# Altium schematic sheet FrontPanelConnector.SchDoc
size A4; Date: 08.04.2017; ApprovedBy: ApprovedBy; CheckedBy: CheckedBy; Author: Jan Petrik; CompanyName: FreeDSP; DrawnBy: Jan Petrik; Organization: FreeDSP; DocumentNumber: 15; Revision: B2; SheetNumber: 15; SheetTotal: 16; Version1: N/A; Version2: N/A; Version3: N/A; Change1description: N/A; Change2description: N/A; Change3description: N/A; Change1DrawnBy: N/A; Change2DrawnBy: N/A; Change3DrawnBy: N/A; Change1CheckedBy: N/A; Change2CheckedBy: N/A; Change3CheckedBy: N/A; PreviusVersion_Chng1: N/A; PreviusVersion_Chng2: N/A; PreviusVersion_Chng3: N/A; Variant1description: Standard assembly; Variant2description: N/A; Variant3description: N/A; Variant4description: N/A; email: jan_petrik@centrum.cz; license: CC BY-NC 4.0; PageSetup: Record=PageOptions|CenterHorizontal=True|CenterVertical=True|PrintScale=0.97|XCorrection=1.00|YCorrection=1.00|PrintKind=2|BorderSize=5000000|LeftOffset=0|BottomOffset=0|Orientation=2|PaperLength=1000|PaperWidth=1000|Scale=100|PaperSource=7|PrintQuality=-3|MediaType=1|DitherType=10|PrintScaleMode=1|PaperKind=A4|PaperIndex=9; drawing number: blablabla; DocumentName: Docname
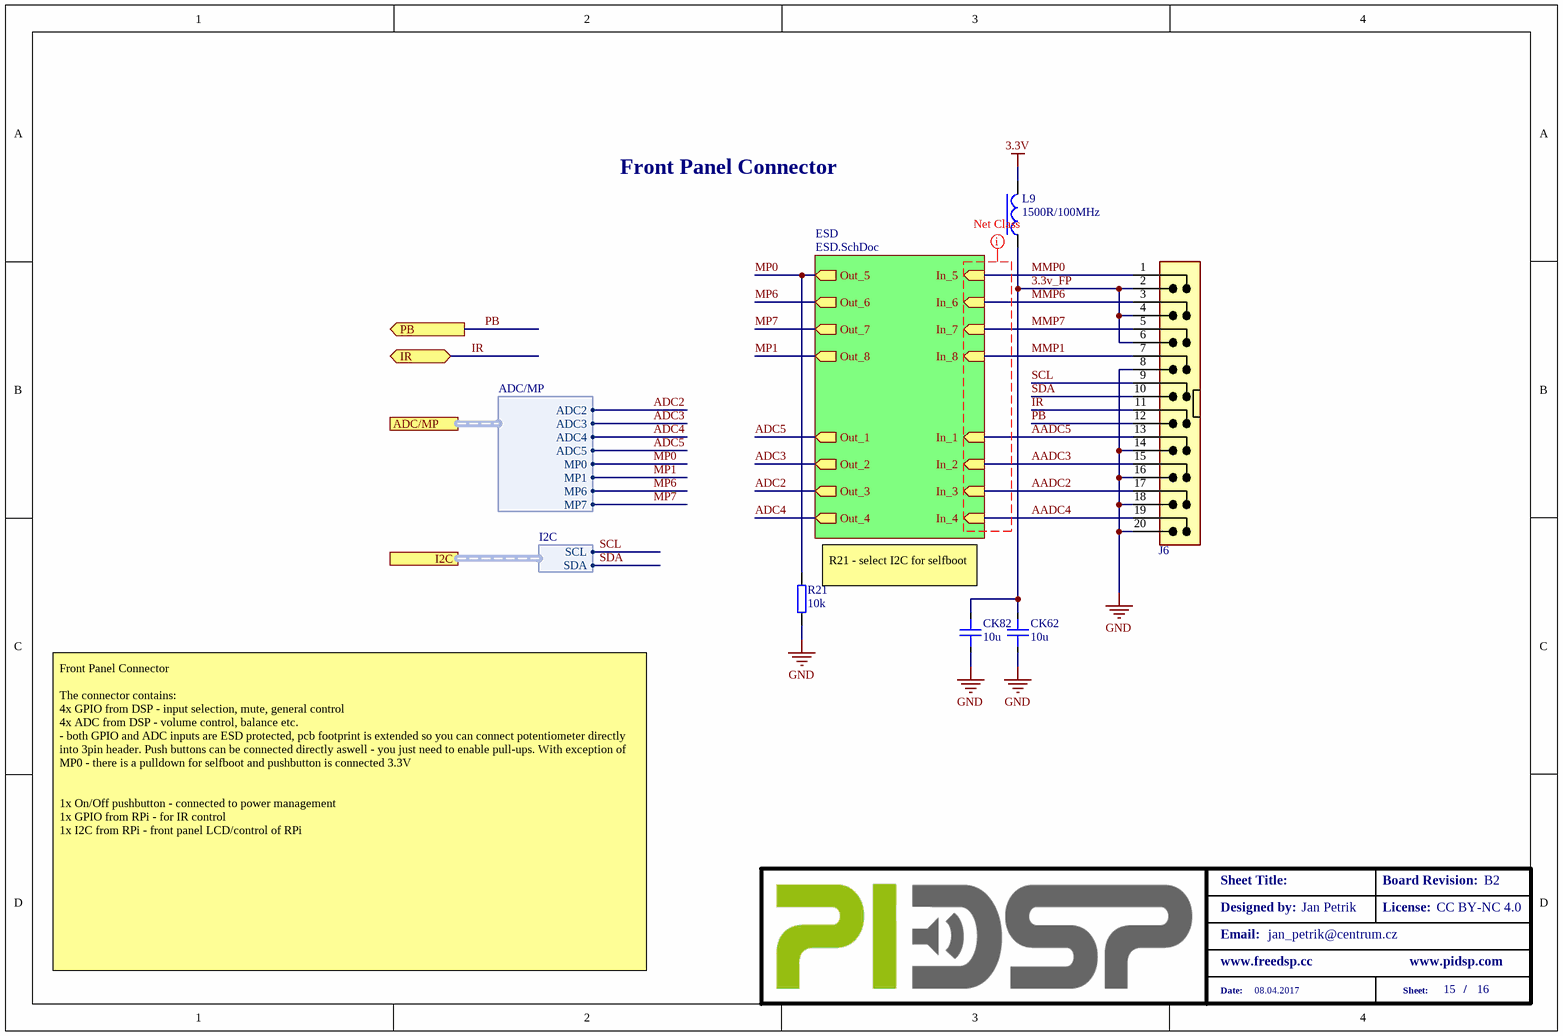
[diagram p0: FrontPanelConnector.SchDoc]

## Parts
CK62  10u  [CAPC3216X12N(SMC1206)]
CK82  10u  [CAPC3216X12N(SMC1206)]
J6  MLW 2x10  [MLW20G_BG]  (value not drawn)
L9  1500R/100MHz  [INDC2012X08N(SML0805)]
R21  10k  [RESC1608X06N(SMR0603)]

## Sub-sheets
ESD = ESD.SchDoc: In_7 (in), In_4 (in), In_3 (in), Out_7 (out), In_8 (in), Out_8 (out), In_6 (in), In_5 (in), Out_5 (out), Out_6 (out), Out_2 (out), Out_4 (out), In_1 (in), In_2 (in), Out_3 (out), Out_1 (out)

## Ports
ADC/MP (harness ADC/MP), I2C (harness I2C), IR (bidir), PB (out)

## Harnesses
ADC/MP: ADC2, ADC3, ADC4, ADC5, MP1, MP0, MP7, MP6
I2C: SCL, SDA

## Nets
3.3V: L9.2
GND: CK62.2 CK82.2 J6.8 J6.14 J6.16 J6.18 J6.20 R21.1
3.3v_FP: CK62.1 CK82.1 J6.2 J6.4 J6.6 L9.1
AADC2: J6.17 ; sheet ESD/In_3
AADC3: J6.15 ; sheet ESD/In_2
AADC4: J6.19 ; sheet ESD/In_4
AADC5: J6.13 ; sheet ESD/In_1
ADC2: sheet ESD/Out_3, port ADC/MP.ADC2
ADC3: sheet ESD/Out_2, port ADC/MP.ADC3
ADC4: sheet ESD/Out_4, port ADC/MP.ADC4
ADC5: sheet ESD/Out_1, port ADC/MP.ADC5
IR: J6.11 ; port IR
MMP0: J6.1 ; sheet ESD/In_5
MMP1: J6.7 ; sheet ESD/In_8
MMP6: J6.3 ; sheet ESD/In_6
MMP7: J6.5 ; sheet ESD/In_7
MP0: R21.2 ; sheet ESD/Out_5, port ADC/MP.MP0
MP1: sheet ESD/Out_8, port ADC/MP.MP1
MP6: sheet ESD/Out_6, port ADC/MP.MP6
MP7: sheet ESD/Out_7, port ADC/MP.MP7
PB: J6.12 ; port PB
SCL: J6.9 ; port I2C.SCL
SDA: J6.10 ; port I2C.SDA

## Layout directives
net class ReducedClearence: (no net found under the mark)

## Notes on the sheet
- Front Panel Connector
- R21 - select I2C for selfboot
- Front Panel Connector
  The connector contains:
  4x GPIO from DSP - input selection, mute, general control
  4x ADC from DSP - volume control, balance etc.
  - both GPIO and ADC inputs are ESD protected, pcb footprint is extended so you can connect potentiometer directly into 3pin header. Push buttons can be connected directly aswell - you just need to enable pull-ups. With exception of  MP0 - there is a pulldown for selfboot and pushbutton is connected 3.3V
  1x On/Off pushbutton - connected to power management
  1x GPIO from RPi - for IR control
  1x I2C from RPi - front panel LCD/control of RPi
- Designed by:
- Sheet Title:
- Board Revision:
- License:
- Email:
- www.freedsp.cc
- www.pidsp.com
- Date:
- Sheet:
- /

## Library data of the parts
CK62 CK82 = 10u-50V-1206-X5R: MLCC; Signal Integrity: Cap; Tolerance: 10%; Voltage: 50; Mfgr. PN: GRM31CR61H106MA2L; Mfgr.: Murata; Value: 10u; Package: SMC1206; Simulation: Cap; Author: JP/10.06.2014; Supplier 1: Mouser; Supplier Part Number 1: 81-GRM31CR61H106MA2L
L9 = MMZ2012Y152B: Multilayer SMD Ferrite 1500R/100MHz; Tolerance & Rating: 25%, 100mA/0.55Ohm RDC; Value: 1500R/100MHz; Author: JP/05.06.2014; SMD: 1; Supplier 1: Mouser; Supplier Part Number 1: 810-MMZ2012Y152B
R21 = 10k-100mW-0603-ThickFilm: Chip Resistor; Tolerance & Rating: 1%/0.1W; Signal Integrity: Res; Packare: SMR0603; Value: 10k; Simulation: Res; Author: JP/10.06.2014; SMD: 1; Supplier 1: Mouser; Supplier Part Number 1: 603-RC0603FR-0710KL; Type: Resistor
J6 = MLW 2x10: smd: 0; Supplier 1: Mouser; Supplier Part Number 1: 710-61202021621